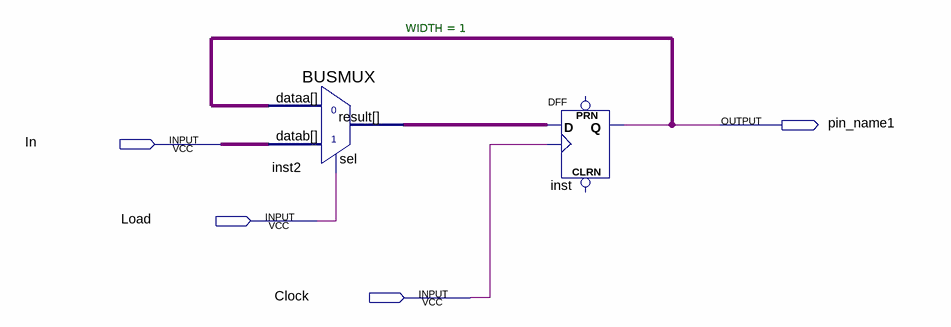
[diagram p0: schematic sheet]
// Quartus schematic register.bdf as structural Verilog: 2 symbols, 4 pins
module register (
  input  In,
  input  Load,
  input  Clock,
  output pin_name1
);

  wire inst2_result, undriven;

  BUSMUX #(.WIDTH(1)) inst2 (.datab(In), .sel(Load), .dataa(undriven), .result(inst2_result));
  DFF inst (.CLK(Clock), .D(inst2_result), .Q(pin_name1));  // open: CLRN, PRN
endmodule
